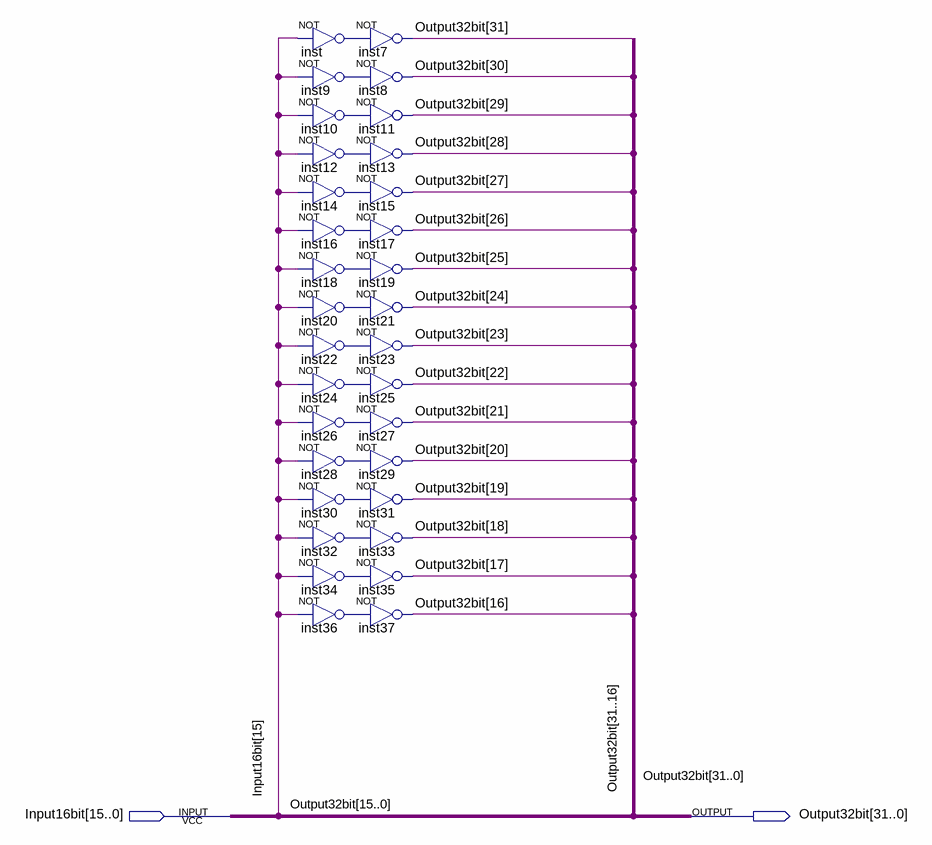
[diagram p0: schematic sheet]
// Quartus schematic signextend16to32bit.bdf as structural Verilog: 32 symbols, 2 pins
module signextend16to32bit (
  input  [15:0] Input16bit,
  output [31:0] Output32bit
);

  wire inst9_out, inst10_out, inst12_out, inst14_out, inst16_out, inst18_out, inst20_out, inst22_out,
       inst24_out, inst26_out, inst28_out, inst30_out, inst32_out, inst34_out, inst36_out, inst_out;

  not inst (inst_out, Input16bit[15]);
  not inst9 (inst9_out, Input16bit[15]);
  not inst10 (inst10_out, Input16bit[15]);
  not inst12 (inst12_out, Input16bit[15]);
  not inst14 (inst14_out, Input16bit[15]);
  not inst16 (inst16_out, Input16bit[15]);
  not inst18 (inst18_out, Input16bit[15]);
  not inst20 (inst20_out, Input16bit[15]);
  not inst22 (inst22_out, Input16bit[15]);
  not inst24 (inst24_out, Input16bit[15]);
  not inst26 (inst26_out, Input16bit[15]);
  not inst28 (inst28_out, Input16bit[15]);
  not inst30 (inst30_out, Input16bit[15]);
  not inst32 (inst32_out, Input16bit[15]);
  not inst34 (inst34_out, Input16bit[15]);
  not inst36 (inst36_out, Input16bit[15]);
  not inst7 (Output32bit[31], inst_out);
  not inst8 (Output32bit[30], inst9_out);
  not inst11 (Output32bit[29], inst10_out);
  not inst13 (Output32bit[28], inst12_out);
  not inst15 (Output32bit[27], inst14_out);
  not inst17 (Output32bit[26], inst16_out);
  not inst19 (Output32bit[25], inst18_out);
  not inst21 (Output32bit[24], inst20_out);
  not inst23 (Output32bit[23], inst22_out);
  not inst25 (Output32bit[22], inst24_out);
  not inst27 (Output32bit[21], inst26_out);
  not inst29 (Output32bit[20], inst28_out);
  not inst31 (Output32bit[19], inst30_out);
  not inst33 (Output32bit[18], inst32_out);
  not inst35 (Output32bit[17], inst34_out);
  not inst37 (Output32bit[16], inst36_out);

  assign Output32bit[15:0] = Input16bit;
endmodule
